# Altium schematic sheet Bank.SchDoc
size A4
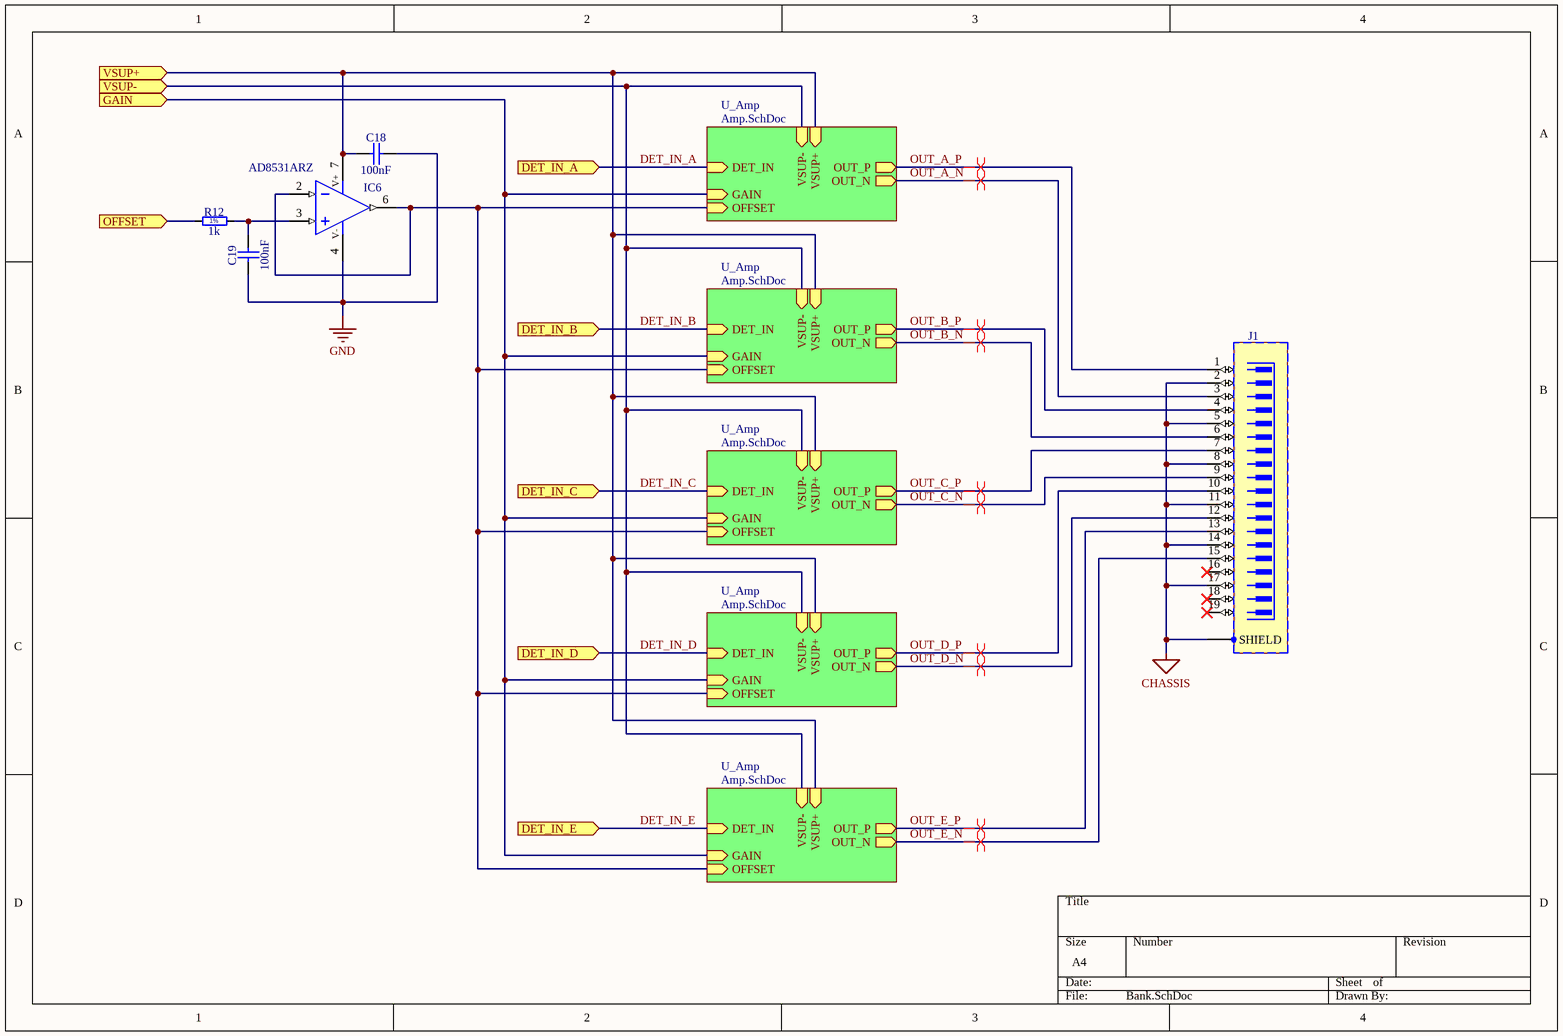
[diagram p0: Bank.SchDoc]

## Parts
C18  100nF  [CAPC2012X135N]
C19  100nF  [CAPC2012X135N]
IC6  AD8531ARZ  [SOIC127P600X175-8N]
J1  HDMI  [TYCO_2007435-1]  (value not drawn)
R12  1k  [RESC2012X60N]

## Sub-sheets
U_Amp = Amp.SchDoc: VSUP+ (in), VSUP- (in), DET_IN (in), OFFSET (in), OUT_P (out), OUT_N (out), GAIN (in)
U_Amp = Amp.SchDoc: VSUP+ (in), VSUP- (in), DET_IN (in), OFFSET (in), OUT_P (out), OUT_N (out), GAIN (in)
U_Amp = Amp.SchDoc: VSUP+ (in), VSUP- (in), DET_IN (in), OFFSET (in), OUT_P (out), OUT_N (out), GAIN (in)
U_Amp = Amp.SchDoc: VSUP+ (in), VSUP- (in), DET_IN (in), OFFSET (in), OUT_P (out), OUT_N (out), GAIN (in)
U_Amp = Amp.SchDoc: VSUP+ (in), VSUP- (in), DET_IN (in), OFFSET (in), OUT_P (out), OUT_N (out), GAIN (in)

## Ports
DET_IN_A (in), DET_IN_B (in), DET_IN_C (in), DET_IN_D (in), DET_IN_E (in), GAIN (in), OFFSET (in), VSUP+ (in), VSUP- (in)

## Nets
CHASSIS: J1.2 J1.5 J1.8 J1.11 J1.14 J1.17 J1.SHIELD
GND: C18.2 C19.1 IC6.4(V-)
DET_IN_A: port DET_IN_A, sheet U_Amp/DET_IN
DET_IN_B: port DET_IN_B, sheet U_Amp/DET_IN
DET_IN_C: port DET_IN_C, sheet U_Amp/DET_IN
DET_IN_D: port DET_IN_D, sheet U_Amp/DET_IN
DET_IN_E: port DET_IN_E, sheet U_Amp/DET_IN
GAIN: port GAIN, sheet U_Amp/GAIN, sheet U_Amp/GAIN, sheet U_Amp/GAIN, sheet U_Amp/GAIN, sheet U_Amp/GAIN
OFFSET: R12.1 ; port OFFSET
OUT_A_N: J1.3 ; sheet U_Amp/OUT_N
OUT_A_P: J1.1 ; sheet U_Amp/OUT_P
OUT_B_N: J1.6 ; sheet U_Amp/OUT_N
OUT_B_P: J1.4 ; sheet U_Amp/OUT_P
OUT_C_N: J1.9 ; sheet U_Amp/OUT_N
OUT_C_P: J1.7 ; sheet U_Amp/OUT_P
OUT_D_N: J1.12 ; sheet U_Amp/OUT_N
OUT_D_P: J1.10 ; sheet U_Amp/OUT_P
OUT_E_N: J1.15 ; sheet U_Amp/OUT_N
OUT_E_P: J1.13 ; sheet U_Amp/OUT_P
VSUP+: C18.1 IC6.7(V+) ; port VSUP+, sheet U_Amp/VSUP+, sheet U_Amp/VSUP+, sheet U_Amp/VSUP+, sheet U_Amp/VSUP+, sheet U_Amp/VSUP+
VSUP-: port VSUP-, sheet U_Amp/VSUP-, sheet U_Amp/VSUP-, sheet U_Amp/VSUP-, sheet U_Amp/VSUP-, sheet U_Amp/VSUP-
NetC19_2: C19.2 IC6.3(IN+) R12.2
NetIC6_2: IC6.2(IN-) IC6.6(OUT) ; sheet U_Amp/OFFSET, sheet U_Amp/OFFSET, sheet U_Amp/OFFSET, sheet U_Amp/OFFSET, sheet U_Amp/OFFSET

Not connected (* = marked no-connect by the designer): J1 16* 18* 19*

## Layout directives
differential pair: OUT_A_N, OUT_A_P, OUT_B_N, OUT_B_P, OUT_C_N, OUT_C_P, OUT_D_N, OUT_D_P, OUT_E_N, OUT_E_P

## Notes on the sheet
- (in symbol R0805_1K_1%_0.125W_100PPM) 1%

## Library data of the parts
C18 C19 = CC0805_100NF_50V_10%_X7R: Non-polarised capacitor; Part Description: SMD Multilayer Chip Ceramic Capacitor; Manufacturer: GENERIC; Manufacturer1 Part Number: C2012X7R1H104K085AA; Voltage: 50V; TC: X7R; Tolerance: ±10%; Part Number: CC0805_100NF_50V_10%_X7R; Component Kind: Standard; Component Type: Standard; Pin Count: 2; Value: 100nF; Status: Preferred; Manufacturer Part Number: CC0805_100NF_50V_10%_X7R; Case: 0805; Mounted: Yes; Socket: No; SMD: Yes; Sense: No; Manufacturer1 Example: TDK; Manufacturer1 ComponentHeight: 1mm; HelpURL: \\cern.ch\dfs\Applications\Altium\Datasheets\CC0805_X7R_TDK_C.pdf; Author: CERN DEM JLC; CreateDate: 03.12.2007; LatestRevisionDate: 22.04.2015
IC6 = AD8531ARZ: Operational Amplifier; Part Description: Low Cost, 250 mA Output, Single-Supply Amplifier; Manufacturer: ANALOG DEVICES; PressFit: No; Bonding: No; Part Number: AD8531ARZ; Component Kind: Standard; Component Type: Standard; Device: AD8531ARZ; PackageDescription: SOIC 8, Pitch 1.27mm - Body 4x5mm, IPC Medium Density; Manufacturer Part Number: AD8531ARZ; Pin Count: 8; Case: SOIC8; Mounted: Yes; Socket: No; SMD: Yes; Sense: No; ComponentHeight: 1.75mm; Author: CERN DEM JLC; HelpURL: \\cern.ch\dfs\Applications\Altium\Datasheets\AD8531ARZ.pdf; CreateDate: 12.06.2013; LatestRevisionDate: 12.06.2013
J1 = TYCO_2007435-1: Connector HDMI 19 Male + 1 Shield; Part Description: 0.578mm Pitch, Through-Hole Right Angle 19 Contacts Flag-HDMI Type-A Receptacle Thru Hole Mounting Pads; Manufacturer: TYCO ELECTRONICS; PressFit: No; Part Number: TYCO_2007435-1; Component Kind: Standard; Component Type: Standard; Pin Count: 23; Family: HDMI; Mounted: Yes; Socket: No; SMD: No; Sense: No; Status: None; Manufacturer Part Number: 2007435-1; ComponentHeight: 16.4mm; HelpURL: \\cern.ch\dfs\Applications\Altium\Datasheets\TYCO_2007435-1.pdf; Author: CERN DEM MR; CreateDate: 05.07.2016; LatestRevisionDate: 05.07.2016
R12 = R0805_1K_1%_0.125W_100PPM: Resistor - 1%; Part Description: General Purpose Thick Film Chip Resistor; Manufacturer: GENERIC; Manufacturer1 Part Number: NRC10F1001TRF; Power: 0.125W; TC: ±100ppm/°C; PressFit: No; Part Number: R0805_1K_1%_0.125W_100PPM; Component Kind: Standard; Component Type: Standard; Pin Count: 2; Value: 1k; Status: Preferred; Tolerance: ±1%; Manufacturer Part Number: R0805_1K_1%_0.125W_100PPM; Case: 0805; Mounted: Yes; Sense: No; Socket: No; SMD: Yes; Manufacturer1 Example: NIC COMPONENT; Manufacturer1 ComponentHeight: 0.6mm; HelpURL: \\cern.ch\dfs\Applications\Altium\Datasheets\R0805_NIC_NRC.pdf; Author: CERN DEM JLC; CreateDate: 03.12.2007; LatestRevisionDate: 13.03.2008